# EasyEDA Pro project TDX_Pro_touchsubboard_1.0.epro

# Board PCB3
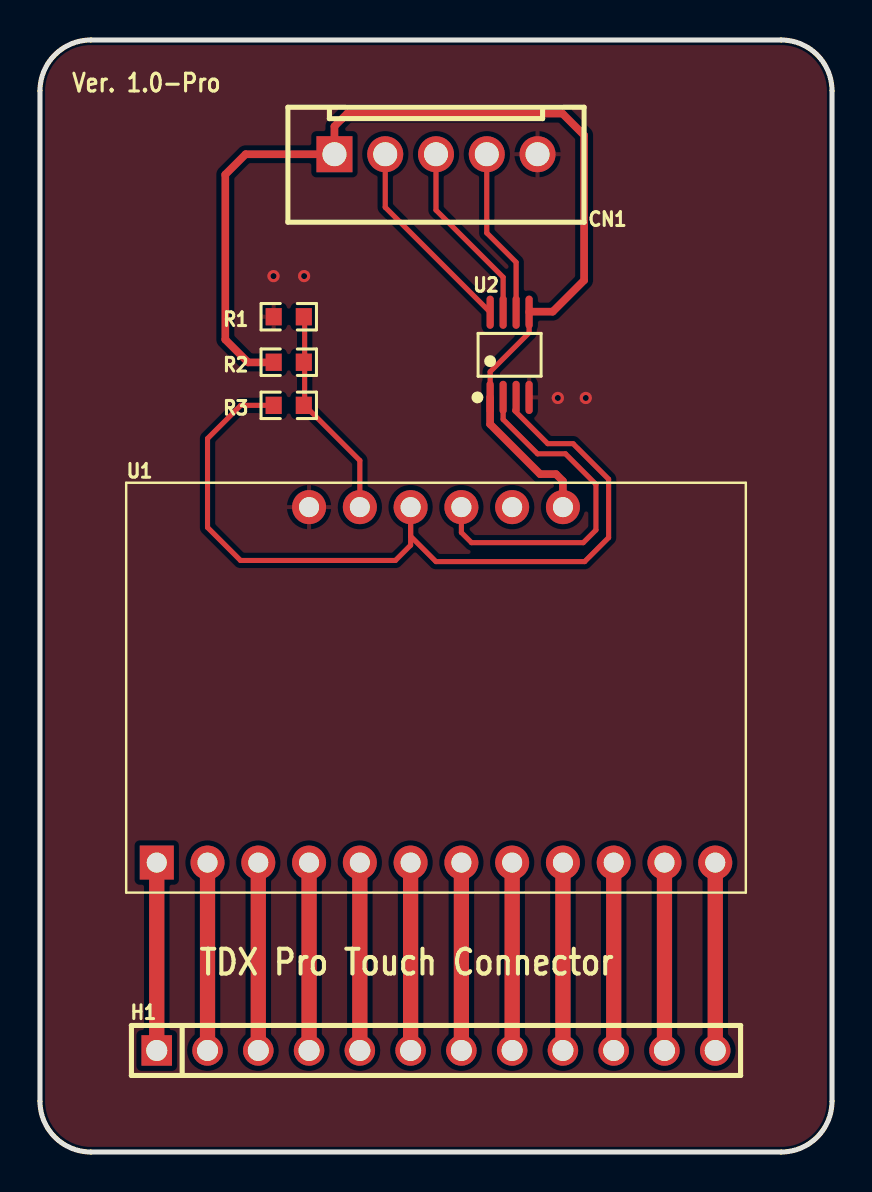
[diagram p0: board, top side]
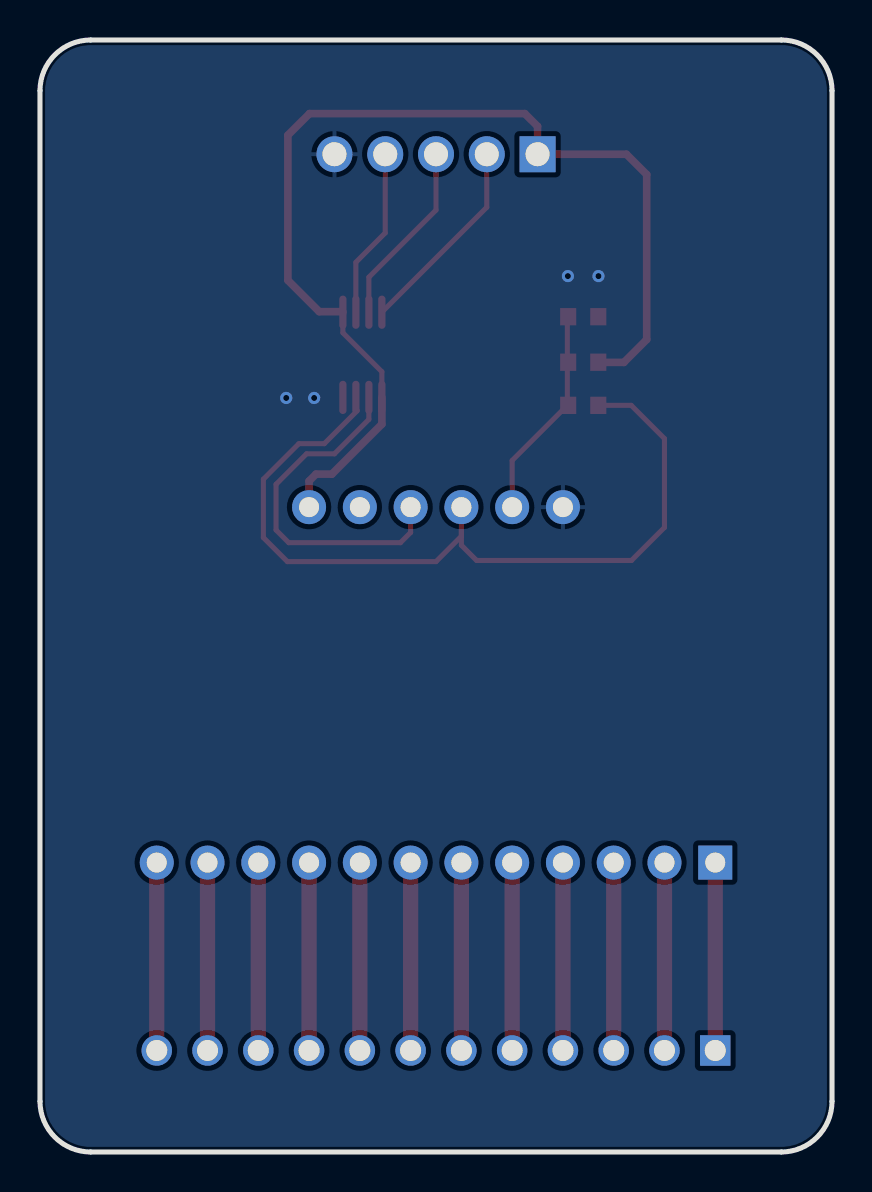
[diagram p1: board, bottom side, seen from below]

Outline 39.62 x 55.63 mm; copper layers: Top Layer, Bottom Layer. Coordinates in mm from the lower left corner of the outline.
Outline path: 0,53.09 0,2.54 arc(0.74,0.74) 2.54,0 37.08,0 arc(38.88,0.74) 39.62,2.54 39.62,53.09 arc(38.88,54.88) 37.08,55.63 2.54,55.63 arc(0.74,54.88) 0,53.09
Stack: Top Layer 0.035mm / Dielectric1 1.51mm FR4 er 4.5 / Bottom Layer 0.035mm

## Design rules (mm)
template: JLCPCB Capability(Two Layers Board)
spacing copperThickness1oz (default): track to track 0.102, other pairs 0.152 to 0.3
spacing copperThickness2oz: track to track 0.203, other pairs 0.152 to 0.3
track width copperThickness1oz (default): min 0.127, default 0.254, max 2.54
track width copperThickness2oz: min 0.203, default 0.254, max 2.54
differential pair differentialPair (default): width min 0.127, default 0.254, max 2.54; gap min 0.152, default 0.152
via viaSize (default): diameter min 0.5, default 0.61, max 10; hole min 0.3, default 0.305, max 6.3

## Placement (name value [footprint] x y rotation side)
CN1  B5B-XH-A(LF)(SN)  [CONN-TH_B5B-XH-A-LF-SN]  19.81 49.91 180 top
H1  PZ254V-11-12P  [HDR-TH_12P-P2.54-V-M]  19.81 5.08 0 top
R1  0Ω  [R0603]  12.45 41.78 0 top
R2  0Ω  [R0603]  12.45 39.51 0 top
R3  0Ω  [R0603]  12.45 37.35 0 top
U1  -  [mai_io:MPR121_BOARD]  19.81 14.48 0 top
U2  TCA9517ADGKR  [VSSOP-8_L3.0-W3.0-P0.65-LS5.0-BL]  23.5 39.88 0 top

## Footprints (pads in the part's own frame, mm; a bottom-side part is the same pattern mirrored in y, then rotated)
CONN-TH_B5B-XH-A-LF-SN
  rect 1.8x1.8 hole 1.2: 1(5.08,0)
  round 1.8 hole 1.2: 2(2.54,0) 3(0,0) 4(-2.54,0) 5(-5.08,0)
HDR-TH_12P-P2.54-V-M
  rect 1.524x1.524 hole 1.05: 1(-13.97,0)
  round 1.524 hole 1.05: 2(-11.43,0) 3(-8.89,0) 4(-6.35,0) 5(-3.81,0) 6(-1.27,0) 7(1.27,0) 8(3.81,0) 9(6.35,0) 10(8.89,0) 11(11.43,0) 12(13.97,0)
mai_io:MPR121_BOARD
  round 1.7 hole 1: 1(3.81,17.78) 2(1.27,17.78) 3(-1.27,17.78) 4(-3.81,17.78) 6(-6.35,17.78) 9(-11.43,0) 10(-8.89,0) 11(-6.35,0) 12(-3.81,0) 13(-1.27,0) 14(1.27,0) 15(3.81,0) 16(6.35,0) 17(8.89,0) 18(11.43,0) 19(13.97,0) 20(6.35,17.78)
  rect 1.7x1.7 hole 1: 8(-13.97,0)
R0603
  rect 0.806x0.864 smd: 1(-0.753,0) 2(0.753,0)
VSSOP-8_L3.0-W3.0-P0.65-LS5.0-BL
  oval 0.364x1.662 smd: 1(-0.975,-2.131) 2(-0.325,-2.131) 3(0.325,-2.131) 4(0.975,-2.131) 5(0.975,2.131) 6(0.325,2.131) 7(-0.325,2.131) 8(-0.975,2.131)

## Nets
+3V3: CN1.1 R2.1 U1.20 U2.1 U2.5
GND: CN1.5 R1.1 U1.6 U2.4
VCCB: CN1.2 U2.8
ADDRESS_SWITCH: R1.2 R2.2 R3.2 U1.4
SCLA: U1.2 U2.2
SCLB: CN1.3 U2.7
SDAA: R3.1 U1.3 U2.3
SDAB: CN1.4 U2.6
TOUCH_1: H1.1 U1.8
TOUCH_2: H1.2 U1.9
TOUCH_3: H1.3 U1.10
TOUCH_4: H1.4 U1.11
TOUCH_5: H1.5 U1.12
TOUCH_6: H1.6 U1.13
TOUCH_7: H1.7 U1.14
TOUCH_8: H1.8 U1.15
TOUCH_9: H1.9 U1.16
TOUCH_10: H1.10 U1.17
TOUCH_11: H1.11 U1.18
TOUCH_12: H1.12 U1.19

Pads without a net: U1 1

## Via types
v1: diameter 0.61, hole 0.305, Top Layer to Bottom Layer, 4 vias

## Routing (per net, layer and track width the routed paths; a pad name or vN(x,y) marks a point on that pad's centre or on a via; arc(x,y) is an arc through that point)
GND:
  vias: v1(11.68,43.82) v1(13.21,43.82) v1(25.91,37.72) v1(27.31,37.72)
+3V3: length 54
  Top Layer w0.254: U2.1 22.52,39.03 24.47,40.98 U2.5
  Top Layer w0.381: 11.65,39.5 10.41,39.5 9.27,40.64 9.27,48.9 10.29,49.91 13.94,49.91 ; CN1.1 14.73,51.31 15.37,51.94 26.14,51.94 27.22,50.86 27.22,43.61 25.65,42.04 24.5,42.04 U2.5 ; U2.1 22.52,36.41 25.02,33.91 25.82,33.91 26.16,33.56 U1.20
VCCB: length 10.1
  Top Layer w0.254: CN1.2 17.27,47.26 U2.8
ADDRESS_SWITCH: length 10.7
  Top Layer w0.254: 13.24,41.78 13.24,37.35 16,34.59 U1.4
SCLA: length 17.8
  Top Layer w0.254: U1.2 21.08,30.99 21.59,30.48 27.18,30.48 27.81,31.12 27.81,33.4 26.29,34.93 24.89,34.93 23.17,36.65 U2.2
SCLB: length 9.3
  Top Layer w0.254: CN1.3 19.81,47.12 23.17,43.76 U2.7
SDAA: length 42.9
  Top Layer w0.254: 11.65,37.35 10.04,37.35 8.38,35.69 8.38,31.24 10.03,29.59 17.78,29.59 18.54,30.35 U1.3 18.54,30.8 19.81,29.53 27.25,29.53 28.45,30.73 28.45,33.66 26.67,35.43 25.4,35.43 23.75,37.08
SDAB: length 8.5
  Top Layer w0.254: CN1.4 22.35,45.97 23.82,44.51 U2.6
TOUCH_1: length 9.4
  Top Layer w0.762: U1.8 H1.1
TOUCH_2: length 9.4
  Top Layer w0.762: U1.9 H1.2
TOUCH_3: length 9.4
  Top Layer w0.762: U1.10 H1.3
TOUCH_4: length 9.4
  Top Layer w0.762: U1.11 H1.4
TOUCH_5: length 9.4
  Top Layer w0.762: U1.12 H1.5
TOUCH_6: length 9.4
  Top Layer w0.762: U1.13 H1.6
TOUCH_7: length 9.4
  Top Layer w0.762: U1.14 H1.7
TOUCH_8: length 9.4
  Top Layer w0.762: U1.15 H1.8
TOUCH_9: length 9.4
  Top Layer w0.762: U1.16 H1.9
TOUCH_10: length 9.4
  Top Layer w0.762: U1.17 H1.10
TOUCH_11: length 9.4
  Top Layer w0.762: U1.18 H1.11
TOUCH_12: length 9.4
  Top Layer w0.762: U1.19 H1.12

## Copper pours and planes (outline as drawn; the poured copper is in the pictures)
GND on Top Layer: -1.78,57.02 41.28,57.02 41.28,-1.78 -1.78,-1.78
GND on Bottom Layer: -2.67,57.79 41.91,57.79 41.91,-2.41 -2.67,-2.41

## Text on the board
Top Silkscreen Layer: Ver. 1.0-Pro | TDX Pro Touch Connector
